# Altium schematic sheet structure_thermometer.SchDoc: Structure thermometer
size A4
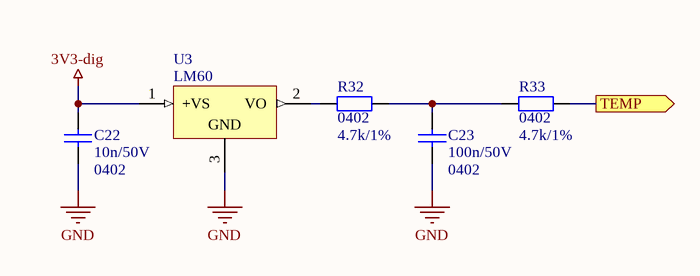
[diagram p0: structure_thermometer.SchDoc]

## Parts
C22  Package: 0402  [SMD_Capacitor_0402]  (hidden comment: 10n/50V)
C23  Package: 0402  [SMD_Capacitor_0402]  (hidden comment: 100n/50V)
R32  Package: 0402  [SMD_Resistor_0402]  (hidden comment: 4.7k/1%)
R33  Package: 0402  [SMD_Resistor_0402]  (hidden comment: 4.7k/1%)
U3  LM60  [SOT23-3]

## Ports
TEMP (out)

## Nets
3V3-dig: C22.1 U3.1(+VS)
GND: C22.2 C23.2 U3.3(GND)
TEMP: R33.2 ; port TEMP
NetC23_1: C23.1 R32.2 R33.1
NetR32_1: R32.1 U3.2(VO)

## Notes on the sheet
- Title:
- Sheet:
- of
- Author:
- Model:
- Document Number:
- Checked by:
- Iss-Rev:
- Approved by:
- Date:
- File name:

## Library data of the parts
C22 C23 = Cer_C0402T103K5RALTU: Ceramic Cap Kemet COTS 10n/50V X7R 0402; ManufacturerPartNumber: C0402T103K5RALTU; Manufacturer: Kemet
  C22: Value: 10n/50V
  C23: Value: 100n/50V
R32 R33 = CRCW04024K70FKxxxx: 4.7k/1% Vishay CRCW 0402 Resistor. 63mW, 100ppm, 50V.; ManufacturerPartNumber: CRCW04024K70FKxxxx; Manufacturer: Vishay; Value: 4.7k/1%
U3 = LM60: Analog temperature sensor